# EAGLE design wssf_arduino_nano_client (EAGLE 9.6.2)
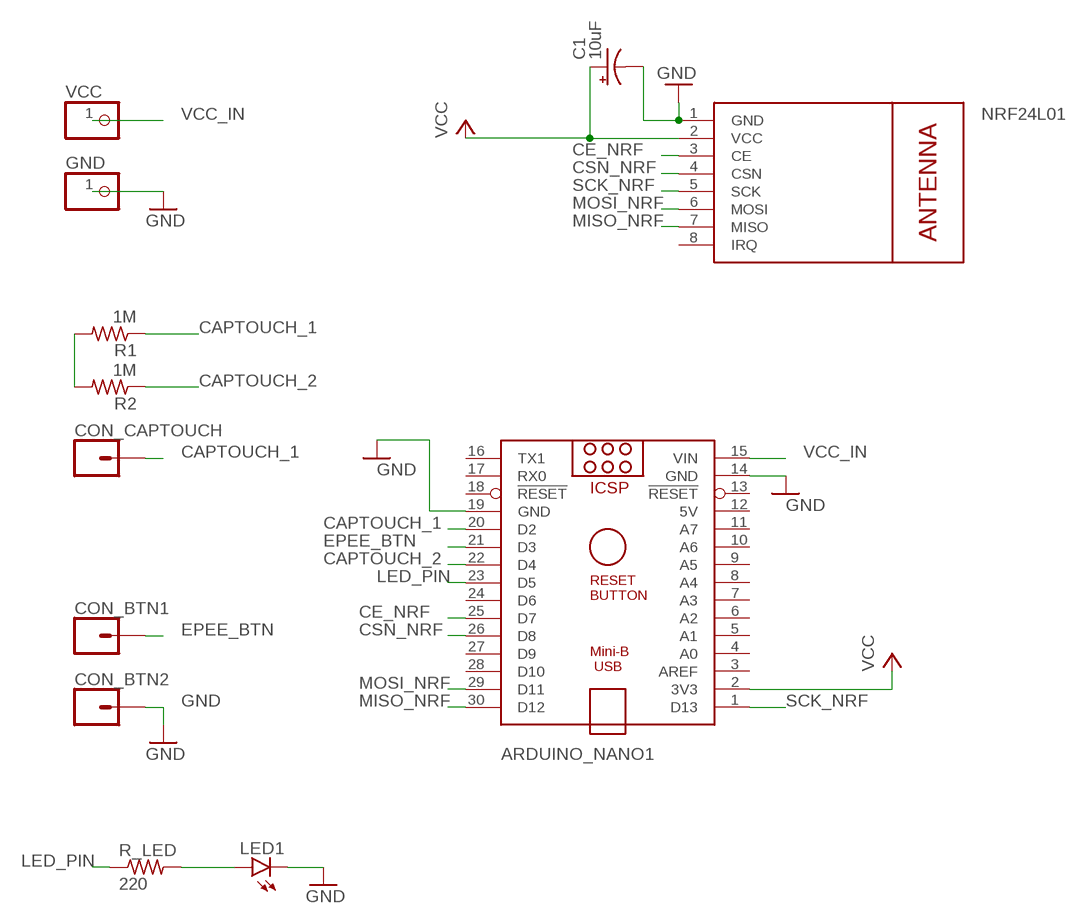
[diagram p0: schematic, sheet 1]

## Parts
ARDUINO_NANO1  ARDUINO_NANO  [ARDUINO_NANO]
C1  10uF  CPOL-USE2-5  [E2-5]
CON_BTN1  CONN_01  [1X01]
CON_BTN2  CONN_01  [1X01]
CON_CAPTOUCH  CONN_01  [1X01]
GND  PINHD-1X1  [1X01]
LED1  LED5MM  [LED5MM]
NRF24L01  WIRELESS-NRF24L01  [WIRELESS-NRF24L01]
R1  1M  R-US_0204/7  [0204/7]
R2  1M  R-US_0204/7  [0204/7]
R_LED  220  R-US_0204/7  [0204/7]
VCC  PINHD-1X1  [1X01]

## Nets
CAPTOUCH_1: ARDUINO_NANO1.20(D2) CON_CAPTOUCH.1 R1.1
CAPTOUCH_2: ARDUINO_NANO1.22(D4) R2.1
CE_NRF: ARDUINO_NANO1.25(D7) NRF24L01.3(CE)
CSN_NRF: ARDUINO_NANO1.26(D8) NRF24L01.4(CSN)
EPEE_BTN: ARDUINO_NANO1.21(D3) CON_BTN1.1
GND: ARDUINO_NANO1.14(GND) ARDUINO_NANO1.19(GND) C1.- CON_BTN2.1 GND.1 LED1.K(C) NRF24L01.1(GND)
LED_PIN: ARDUINO_NANO1.23(D5) R_LED.1
MISO_NRF: ARDUINO_NANO1.30(D12) NRF24L01.7(MISO)
MOSI_NRF: ARDUINO_NANO1.29(D11) NRF24L01.6(MOSI)
N$1: LED1.A R_LED.2
N$3: R1.2 R2.2
SCK_NRF: ARDUINO_NANO1.1(D13) NRF24L01.5(SCK)
VCC: ARDUINO_NANO1.2(3V3) C1.+ NRF24L01.2(VCC)
VCC_IN: ARDUINO_NANO1.15(VIN) VCC.1
Unconnected: ARDUINO_NANO1.3(AREF) ARDUINO_NANO1.4(A0) ARDUINO_NANO1.5(A1) ARDUINO_NANO1.6(A2) ARDUINO_NANO1.7(A3) ARDUINO_NANO1.8(A4) ARDUINO_NANO1.9(A5) ARDUINO_NANO1.10(A6) ARDUINO_NANO1.11(A7) ARDUINO_NANO1.13(!RESET) ARDUINO_NANO1.16(TX1) ARDUINO_NANO1.17(RX0) ARDUINO_NANO1.18(!RESET) ARDUINO_NANO1.24(D6) ARDUINO_NANO1.27(D9) ARDUINO_NANO1.28(D10) NRF24L01.8(IRQ)

## Power pins joined to a net without a drawn wire
5V: ARDUINO_NANO1.12(5V)

## Library data of the parts
ARDUINO_NANO1 = ArduinoNanoV30:ARDUINO_NANO: Arduino Nano V3.0 Overview: The Arduino Nano is a small, complete, and breadboard-friendly board based on the ATmega328 (Arduino Nano 3.x) or ATmega168 (Arduino Nano 2.x). It has more or less the same functionality of the Arduino Duemilanove, but in a different package. It lacks only a DC power jack, and works with a Mini-B USB cable instead of a standard one. The Nano was designed and is being produced by Gravitech. Specifications: Microcontroller Atmel ATmega168 or ATmega328 Operating Voltage (logic level) 5 V Input Voltage (recommended) 7-12 V Input Voltage (limits) 6-20 V Digital I/O Pins 14 (of which 6 provide PWM output) Analog Input Pins 8 DC Current per I/O Pin 40 mA Flash Memory 16 KB (ATmega168) or 32 KB (ATmega328) of which 2 KB used by bootloader SRAM 1 KB (ATmega168) or 2 KB (ATmega328) EEPROM 512 bytes (ATmega168) or 1 KB (ATmega328) Clock Speed 16 MHz Dimensions 0.73" x 1.70" Length 45 mm Width 18 mm Weigth 5 g Power: The Arduino Nano can be powered via the Mini-B USB connection, 6-20V unregulated external power supply (pin 30), or 5V regulated external power supply (pin 27). The power source is automatically selected to the highest voltage source. Memory: The ATmega168 has 16 KB of flash memory for storing code (of which 2 KB is used for the bootloader); the ATmega328 has 32 KB, (also with 2 KB used for the bootloader). The ATmega168 has 1 KB of SRAM and 512 bytes of EEPROM (which can be read and written with the EEPROM library); the ATmega328 has 2 KB of SRAM and 1 KB of EEPROM. Input and Output: Each of the 14 digital pins on the Nano can be used as an input or output, using pinMode(), digitalWrite(), and digitalRead() functions. They operate at 5 volts. Each pin can provide or receive a maximum of 40 mA and has an internal pull-up resistor (disconnected by default) of 20-50 kOhms. In addition, some pins have specialized functions. Visit Arduino - ArduinoBoardNano <https://www.arduino.cc/en/Main/ArduinoBoardNano>
C1 = rcl:CPOL-US: POLARIZED CAPACITOR, American symbol; SPICEPREFIX: C
CON_BTN1 CON_BTN2 CON_CAPTOUCH = SparkFun-Connectors:CONN_01: Single connection point. Often used as Generic Header-pin footprint for 0.1 inch spaced/style header connections On any of the 0.1 inch spaced packages, you can populate with these: Break Away Headers - Straight <https://www.sparkfun.com/products/116> (PRT-00116) Break Away Male Headers - Right Angle <https://www.sparkfun.com/products/553> (PRT-00553) Female Headers <https://www.sparkfun.com/products/115> (PRT-00115) Break Away Headers - Machine Pin <https://www.sparkfun.com/products/117> (PRT-00117) Break Away Female Headers - Swiss Machine Pin <https://www.sparkfun.com/products/743> (PRT-00743) This device is also useful as a general connection point to wire up your design to another part of your project. Our various solder wires solder well into these plated through hole pads. Hook-Up Wire - Assortment (Stranded, 22 AWG) <https://www.sparkfun.com/products/11375> (PRT-11375) Hook-Up Wire - Assortment (Solid Core, 22 AWG) <https://www.sparkfun.com/products/11367> (PRT-11367) View the entire wire category on our website here <https://www.sparkfun.com/categories/141> Special notes: SMTSO-256-ET is a "flush mount" nut for a 4-40 screw. We mostly use this on specialty testbeds; it is a nice way to connect hardware to your PCB at an adjustable hieght. Also note, the SNAP packages are for using a snappable style connector. We sell a baggie of snaps and they are also used on two LilyPad designs: Snap Assortment - 30 pack (male and female) <https://www.sparkfun.com/products/11347> (DEV-11347) LilyPad Arduino SimpleSnap <https://www.sparkfun.com/products/10941> (DEV-10941) LilyPad SimpleSnap Protoboard <https://www.sparkfun.com/products/10940> (DEV-10940)
GND VCC = pinhead:PINHD-1X1: PIN HEADER
LED1 = led:LED: LED OSRAM: - CHIPLED LG R971, LG N971, LY N971, LG Q971, LY Q971, LO R971, LY R971 LH N974, LH R974 LS Q976, LO Q976, LY Q976 LO Q996 - Hyper CHIPLED LW Q18S LB Q993, LB Q99A, LB R99A - SideLED LS A670, LO A670, LY A670, LG A670, LP A670 LB A673, LV A673, LT A673, LW A673 LH A674 LY A675 LS A676, LA A676, LO A676, LY A676, LW A676 LS A679, LY A679, LG A679 - Hyper Micro SIDELED® LS Y876, LA Y876, LO Y876, LY Y876 LT Y87S - SmartLED LW L88C, LW L88S LB L89C, LB L89S, LG L890 LS L89K, LO L89K, LY L89K LS L896, LA L896, LO L896, LY L896 - TOPLED LS T670, LO T670, LY T670, LG T670, LP T670 LSG T670, LSP T670, LSY T670, LOP T670, LYG T670 LG T671, LOG T671, LSG T671 LB T673, LV T673, LT T673, LW T673 LH T674 LS T676, LA T676, LO T676, LY T676, LB T676, LH T676, LSB T676, LW T676 LB T67C, LV T67C, LT T67C, LS T67K, LO T67K, LY T67K, LW E67C LS E67B, LA E67B, LO E67B, LY E67B, LB E67C, LV E67C, LT E67C LW T67C LS T679, LY T679, LG T679 LS T770, LO T770, LY T770, LG T770, LP T770 LB T773, LV T773, LT T773, LW T773 LH T774 LS E675, LA E675, LY E675, LS T675 LS T776, LA T776, LO T776, LY T776, LB T776 LHGB T686 LT T68C, LB T68C - Hyper Mini TOPLED® LB M676 - Mini TOPLED Santana® LG M470 LS M47K, LO M47K, LY M47K Source: http://www.osram.convergy.de LUXEON: - LUMILED® LXK2-PW12-R00, LXK2-PW12-S00, LXK2-PW14-U00, LXK2-PW14-V00 LXK2-PM12-R00, LXK2-PM12-S00, LXK2-PM14-U00 LXK2-PE12-Q00, LXK2-PE12-R00, LXK2-PE12-S00, LXK2-PE14-T00, LXK2-PE14-U00 LXK2-PB12-K00, LXK2-PB12-L00, LXK2-PB12-M00, LXK2-PB14-N00, LXK2-PB14-P00, LXK2-PB14-Q00 LXK2-PR12-L00, LXK2-PR12-M00, LXK2-PR14-Q00, LXK2-PR14-R00 LXK2-PD12-Q00, LXK2-PD12-R00, LXK2-PD12-S00 LXK2-PH12-R00, LXK2-PH12-S00 LXK2-PL12-P00, LXK2-PL12-Q00, LXK2-PL12-R00 Source: www.luxeon.com KINGBRIGHT: KA-3528ASYC Source: www.kingbright.com
NRF24L01 = diy-modules:WIRELESS-NRF24L01: 2.4 GHz Wireless Module based on NRF24L01 chip More details available here: http://www.electrodragon.com/w/NRF24L01 Click here to find device on ebay.com <http://www.ebay.com/sch/nrf24l01+arduino>
R1 R2 R_LED = rcl:R-US_: RESISTOR, American symbol; SPICEPREFIX: R

## Board
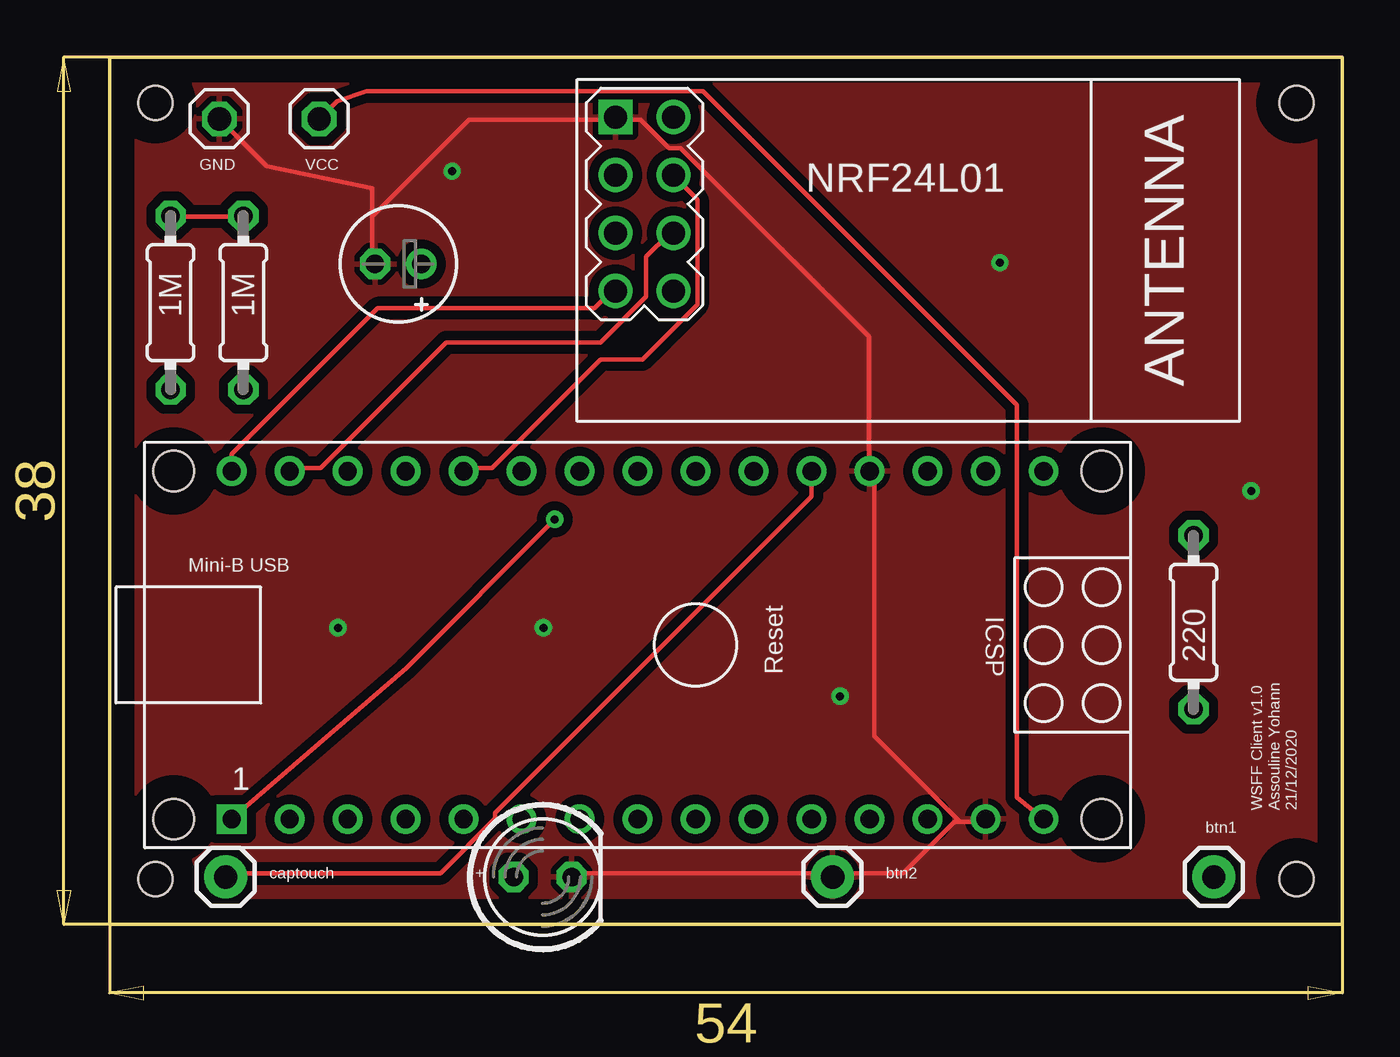
[diagram p1: board, top side]
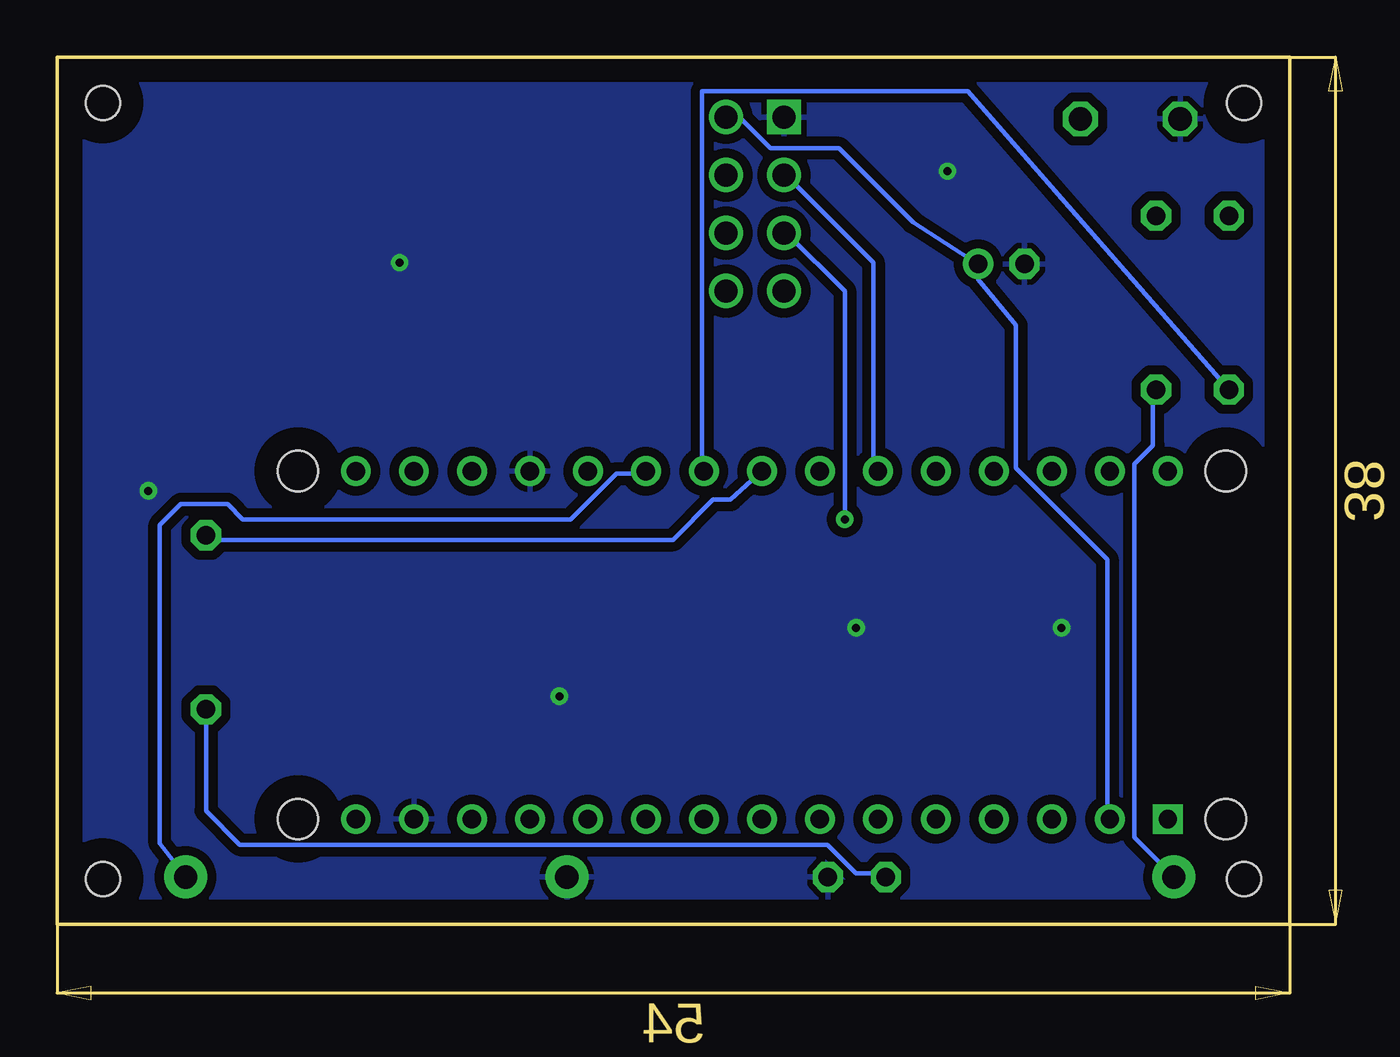
[diagram p2: board, bottom side, seen from below]

Size 54 x 38 mm. Coordinates in mm from the lower left corner, seen from the top.
Outline: 0,0 0,38 54,38 54,0 0,0
Copper layers (1*16): Top 0.035mm / dielectric 1.5mm / Bottom 0.035mm
Design rules "default": minimum track width 6mil, minimum drill 0.35mm, track to track 6mil, track to pad 6mil, pad to pad 6mil, via to via 6mil, smd to smd 6mil, copper to edge 40mil, drill to drill 6mil, minimum pad ring 10mil, minimum via ring 8mil, stop-mask expansion 4mil, vias tented up to drill 0mil, thermal gap 10mil
Holes 1.5 mm at 52,36 2,2 2,36 52,2

### Footprints (pad centres in the part's own frame; a part is rotated, then mirrored left to right if it is on the bottom)
ARDUINO_NANO = drill 0.8 square: 1 -20.32,-7.62 | drill 0.8: 2 -17.78,-7.62; 3 -15.24,-7.62; 4 -12.7,-7.62; 5 -10.16,-7.62; 6 -7.62,-7.62; 7 -5.08,-7.62; 8 -2.54,-7.62; 9 0,-7.62; 10 2.54,-7.62; 11 5.08,-7.62; 12 7.62,-7.62; 13 10.16,-7.62; 14 12.7,-7.62; 15 15.24,-7.62; 16 15.24,7.62; 17 12.7,7.62; 18 10.16,7.62; 19 7.62,7.62; 20 5.08,7.62; 21 2.54,7.62; 22 0,7.62; 23 -2.54,7.62; 24 -5.08,7.62; 25 -7.62,7.62; 26 -10.16,7.62; 27 -12.7,7.62; 28 -15.24,7.62; 29 -17.78,7.62; 30 -20.32,7.62 | hole 1.778: -22.86,-7.62; -22.86,7.62; 17.78,7.62; 17.78,-7.62
E2-5 = drill 0.813 pad 1.27: + -1.016,0 | drill 0.813 pad 1.27 octagon: - 1.016,0
1X01 = drill 1.016 pad 1.88: 1 0,0
1X01' = drill 1.016 octagon: 1 0,0
LED5MM = drill 0.813 octagon: A -1.27,0; K 1.27,0
WIRELESS-NRF24L01 = drill 1 square: 1 -12.7,6.35 | drill 1: 2 -10.16,6.35; 3 -12.7,3.81; 4 -10.16,3.81; 5 -12.7,1.27; 6 -10.16,1.27; 7 -12.7,-1.27; 8 -10.16,-1.27
0204/7 = drill 0.813 octagon: 1 -3.81,0; 2 3.81,0

### Placement (x,y rotation side)
ARDUINO_NANO1  25.67,12.24 0 top
C1  12.64,28.94 180 top
CON_BTN1  48.37,2.08 0 top
CON_BTN2  31.67,2.08 0 top
CON_CAPTOUCH  5.08,2.08 0 top
GND  [1X01']  4.81,35.29 0 top
LED1  18.97,2.08 0 top
NRF24L01  34.86,29.02 0 top
R1  5.86,27.24 90 top
R2  2.67,27.24 90 top
R_LED  47.48,13.24 270 top
VCC  [1X01']  9.18,35.29 0 top

### Tracks (layer width: path | path; a pad name or v marks a point on that pad's centre or on a via)
CAPTOUCH_1
  Top 0.2: ARDUINO_NANO1.20 30.75,18.75 16.89,4.89 16.89,4.64 14.5,2.25 5.25,2.25 CON_CAPTOUCH.1
  Bottom 0.2: CON_CAPTOUCH.1 6.81,3.81 6.81,20.18 6,20.99 6,23.25 R1.1
CAPTOUCH_2
  Bottom 0.2: ARDUINO_NANO1.22 25.75,20 25.75,36.5 14.11,36.5 R2.1
CE_NRF
  Bottom 0.2: ARDUINO_NANO1.25 18.25,20 18.25,29 22,32.75 NRF24L01.3
CSN_NRF
  Top 0.2: ARDUINO_NANO1.26 15.75,20 16.75,20 21.5,24.75 23.33,24.75 25.75,27.17 25.75,31.75 24.75,32.75 NRF24L01.4
EPEE_BTN
  Bottom 0.2: ARDUINO_NANO1.21 28.25,19.75 29.5,19.75 31.5,17.75 45.87,17.75 46.53,18.41 48.59,18.41 49.5,17.5 49.5,3.56 CON_BTN1.1
GND  (via drill 0.35)
  Top 0.2: 11.5,31 11.5,32.25 6.88,33.22 GND.1 | 11.5,31 11.5,29 C1.- | 11.5,31 15.75,35.25 22,35.25 NRF24L01.1 22.25,35.25 23.25,35.25 24.5,34 25,34 33.25,25.75 33.25,20 ARDUINO_NANO1.19 33.5,19.75 33.5,8.25 37.25,4.5 | 37.25,4.5 37,4.5 34.75,2.25 31.75,2.25 CON_BTN2.1 31.5,2.25 20.25,2.25 LED1.K | 37.25,4.5 38.25,4.5 ARDUINO_NANO1.14
  other vias: 10,13 32,10 50,19 39,29 19,13 15,33
  pour Bottom (isolate 0.406): 0,0 0,38 54,38 54,0
  pour Top (isolate 0.406): 0,0 0,38 54,38 54,0
LED_PIN
  Bottom 0.2: R_LED.1 47.28,16.85 27.02,16.85 25.26,18.61 24.49,18.61 ARDUINO_NANO1.23
MISO_NRF
  Top 0.2: ARDUINO_NANO1.30 5.35,20.6 11.75,27 21.25,27 22,27.75 NRF24L01.7
MOSI_NRF
  Top 0.2: ARDUINO_NANO1.29 8,20 9.25,20 14.75,25.5 21.5,25.5 23.5,27.5 23.5,29.25 24.5,30.25 NRF24L01.6
N$1
  Bottom 0.2: R_LED.2 47.48,4.98 46,3.5 20.25,3.5 19,2.25 17.75,2.25 LED1.A
N$3
  Top 0.2: R2.2 2.75,31 5.75,31 R1.2
SCK_NRF  (via drill 0.35)
  Top 0.2: v19.5,17.75 13,11.25 ARDUINO_NANO1.1
  Bottom 0.2: v19.5,17.75 19.5,27.75 22,30.25 NRF24L01.5
VCC
  Bottom 0.2: ARDUINO_NANO1.2 8,4.75 8,16 12,20 12,26.25 13.66,28.27 C1.+ 16.52,30.77 19.75,34 22.75,34 24,35.25 24.5,35.25 NRF24L01.2
VCC_IN
  Top 0.2: ARDUINO_NANO1.15 39.75,5.56 39.75,22.75 26,36.5 11.25,36.5 9.96,36.07 VCC.1

### Text on the board
tPlace: WSFF Client v1.0 / Assouline Yohann / 21/12/2020 | btn1 | captouch | + | btn2